# EAGLE board chipKIT Max32 (EAGLE 5.11)
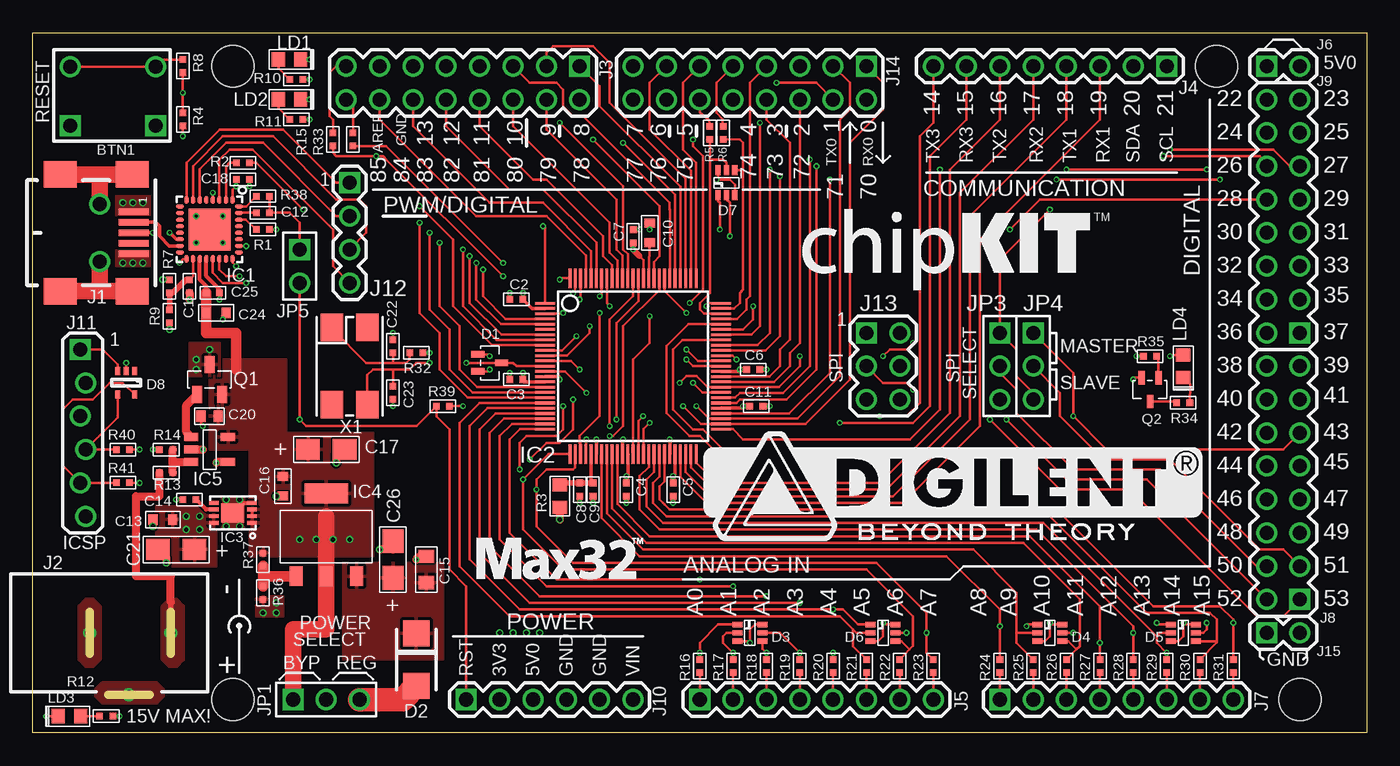
[diagram p5: board, top side]
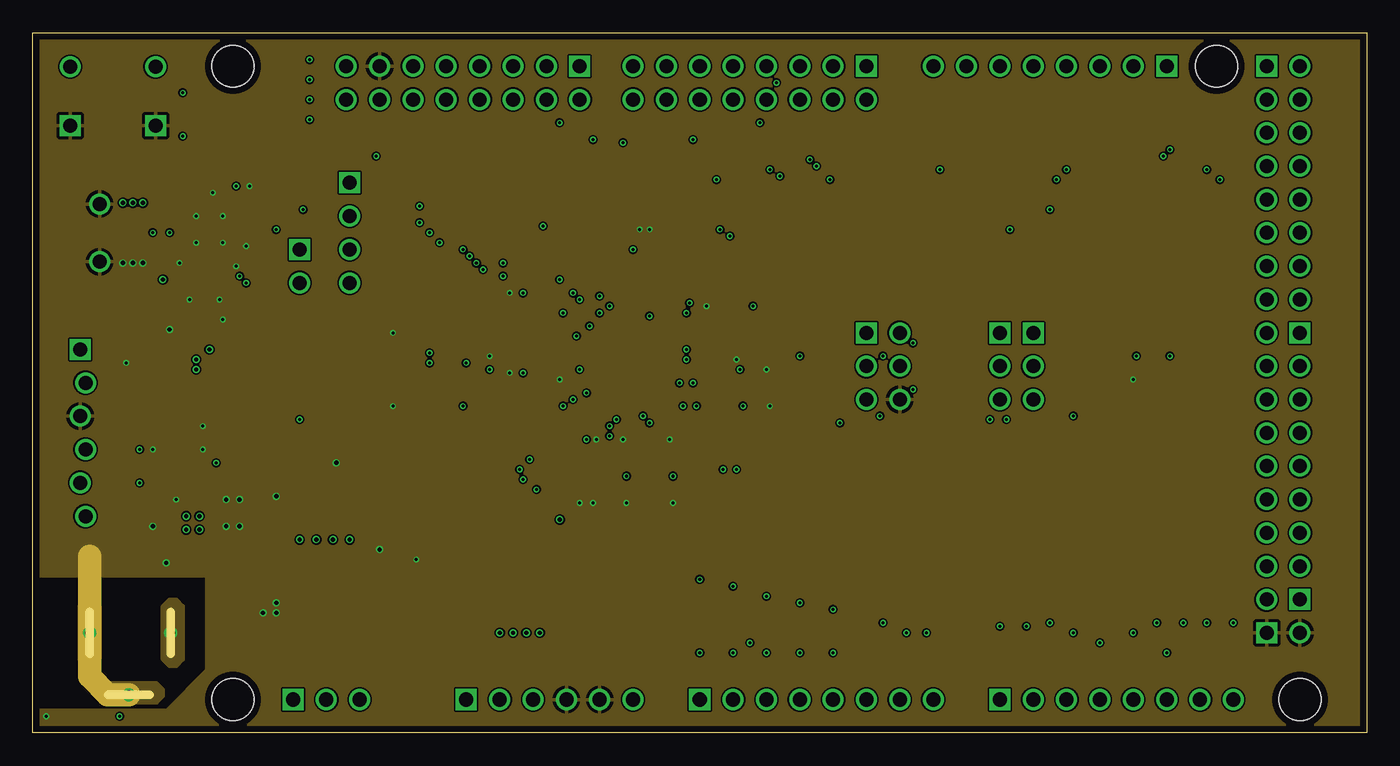
[diagram p6: board, inner layer Route2]
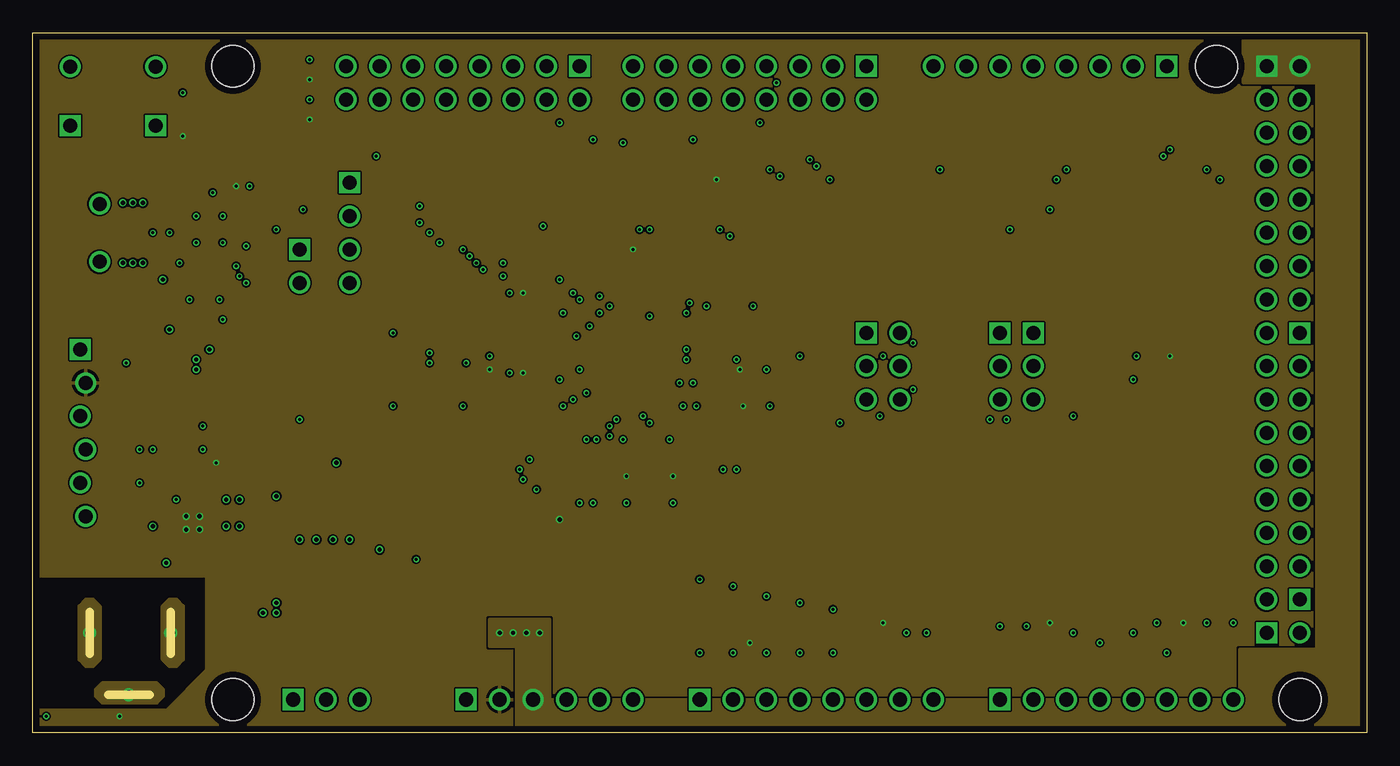
[diagram p7: board, inner layer Route15]
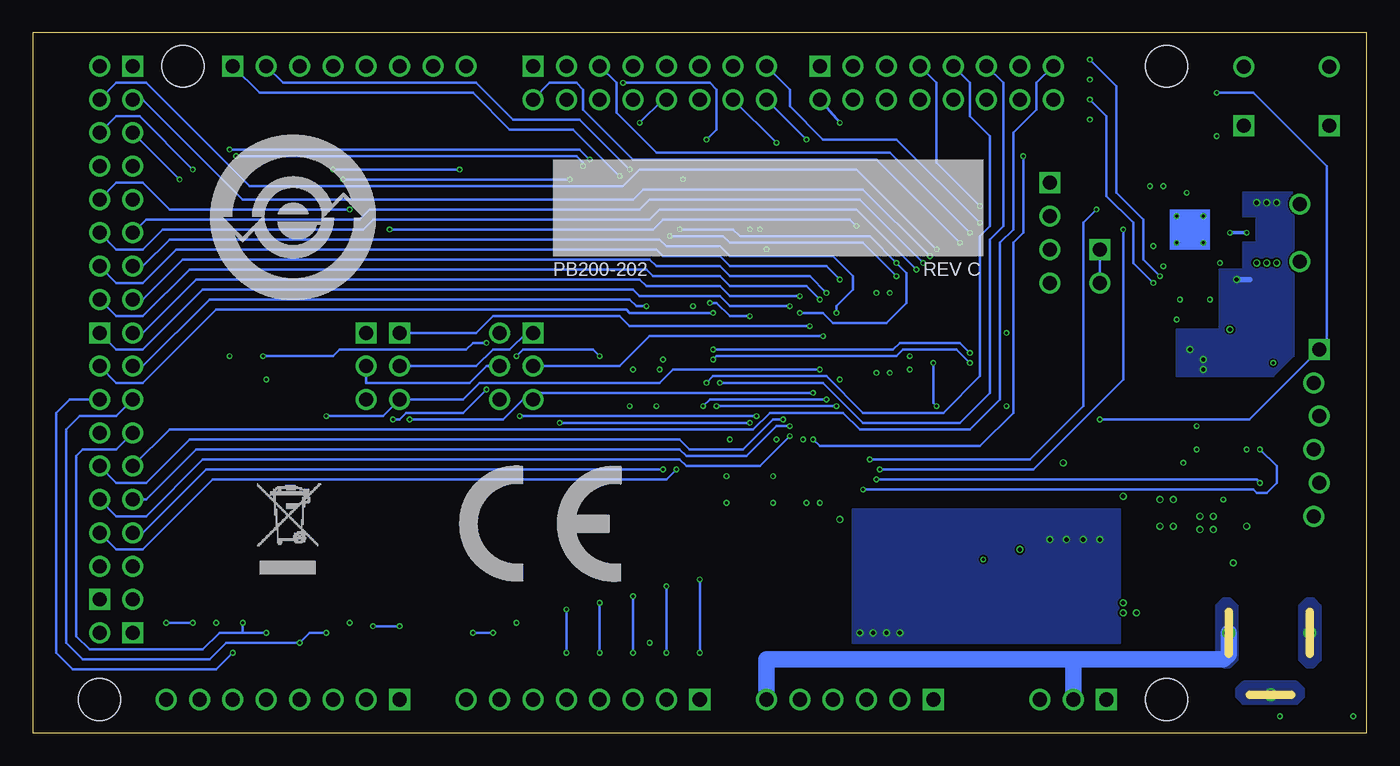
[diagram p8: board, bottom side, seen from below]

Size 101.6 x 53.34 mm. Coordinates in mm from the lower left corner, seen from the top.
Outline: 0,0 0,53.34 101.6,53.34 101.6,0 0,0
Copper layers (1+2*15+16): Top 0.035mm / dielectric 0.3mm / Route2 0.035mm / dielectric 0.83mm / Route15 0.035mm / dielectric 0.3mm / Bottom 0.035mm
Design rules "default *": minimum track width 7mil, minimum drill 9mil, track to track 5mil, track to pad 5mil, pad to pad 5mil, via to via 5mil, smd to smd 0mil, copper to edge 20mil, drill to drill 8mil, minimum pad ring 4mil, minimum via ring 4mil, stop-mask expansion 0mil, vias tented up to drill 15mil, thermal gap 10mil
Holes 3.2 mm at 15.24,50.8 15.24,2.54 90.17,50.8 96.52,2.54

## Footprints (pad centres in the part's own frame; a part is rotated, then mirrored left to right if it is on the bottom)
SW-P8008 = drill 1.067 square: 1A -2,3.5; 2A -2,-3 | drill 1.067 round: 1B 2.5,3.5; 2B 2.5,-3
C0402S = smd 0.5 x 0.5: 1 -0.5,0; 2 0.5,0
C0603S = smd 0.7 x 0.8: 1 -0.75,0; 2 0.75,0
C0805S = smd 1 x 1.2: 1 -1,0; 2 1,0
CPOL3216 = smd 1.8 x 1.6: + -1.4,0; - 1.4,0
C0402 = smd 0.7 x 0.9: 1 -0.65,0; 2 0.65,0
SOT-323 = smd 0.5 x 1: 1 -0.65,-0.9; 2 0.65,-0.9; 3 0,0.9
SMA = smd 2 x 2: A 2,0; C -2,0
SOT-363 = smd 0.4 x 0.762: 1 -0.635,-0.953; 2 0,-0.953; 3 0.635,-0.953; 4 0.635,0.953; 5 0,0.953; 6 -0.635,0.953
SOT-323-5 = smd 0.4 x 0.6: 1 -0.65,-0.9; 2 0,-0.9; 3 0.65,-0.9; 4 0.65,0.9; 5 -0.65,0.9
QFN32 = smd 0.6 x 0.3: 1 -2.25,1.75; 2 -2.25,1.25; 3 -2.25,0.75; 4 -2.25,0.25; 5 -2.25,-0.25; 6 -2.25,-0.75; 7 -2.25,-1.25; 8 -2.25,-1.75; 17 2.25,-1.75; 18 2.25,-1.25; 19 2.25,-0.75; 20 2.25,-0.25; 21 2.25,0.25; 22 2.25,0.75; 23 2.25,1.25; 24 2.25,1.75 | smd 0.3 x 0.6: 9 -1.75,-2.25; 10 -1.25,-2.25; 11 -0.75,-2.25; 12 -0.25,-2.25; 13 0.25,-2.25; 14 0.75,-2.25; 15 1.25,-2.25; 16 1.75,-2.25; 25 1.75,2.25; 26 1.25,2.25; 27 0.75,2.25; 28 0.25,2.25; 29 -0.25,2.25; 30 -0.75,2.25; 31 -1.25,2.25; 32 -1.75,2.25 | smd 3.2 x 3.2: PAD 0,0
TQ100-PT = smd 1.5 x 0.2: 1 -6.7,4.8; 2 -6.7,4.4; 3 -6.7,4; 4 -6.7,3.6; 5 -6.7,3.2; 6 -6.7,2.8; 7 -6.7,2.4; 8 -6.7,2; 9 -6.7,1.6; 10 -6.7,1.2; 11 -6.7,0.8; 12 -6.7,0.4; 13 -6.7,0; 14 -6.7,-0.4; 15 -6.7,-0.8; 16 -6.7,-1.2; 17 -6.7,-1.6; 18 -6.7,-2; 19 -6.7,-2.4; 20 -6.7,-2.8; 21 -6.7,-3.2; 22 -6.7,-3.6; 23 -6.7,-4; 24 -6.7,-4.4; 25 -6.7,-4.8; 51 6.7,-4.8; 52 6.7,-4.4; 53 6.7,-4; 54 6.7,-3.6; 55 6.7,-3.2; 56 6.7,-2.8; 57 6.7,-2.4; 58 6.7,-2; 59 6.7,-1.6; 60 6.7,-1.2; 61 6.7,-0.8; 62 6.7,-0.4; 63 6.7,0; 64 6.7,0.4; 65 6.7,0.8; 66 6.7,1.2; 67 6.7,1.6; 68 6.7,2; 69 6.7,2.4; 70 6.7,2.8; 71 6.7,3.2; 72 6.7,3.6; 73 6.7,4; 74 6.7,4.4; 75 6.7,4.8 | smd 0.2 x 1.5: 26 -4.8,-6.7; 27 -4.4,-6.7; 28 -4,-6.7; 29 -3.6,-6.7; 30 -3.2,-6.7; 31 -2.8,-6.7; 32 -2.4,-6.7; 33 -2,-6.7; 34 -1.6,-6.7; 35 -1.2,-6.7; 36 -0.8,-6.7; 37 -0.4,-6.7; 38 0,-6.7; 39 0.4,-6.7; 40 0.8,-6.7; 41 1.2,-6.7; 42 1.6,-6.7; 43 2,-6.7; 44 2.4,-6.7; 45 2.8,-6.7; 46 3.2,-6.7; 47 3.6,-6.7; 48 4,-6.7; 49 4.4,-6.7; 50 4.8,-6.7; 76 4.8,6.7; 77 4.4,6.7; 78 4,6.7; 79 3.6,6.7; 80 3.2,6.7; 81 2.8,6.7; 82 2.4,6.7; 83 2,6.7; 84 1.6,6.7; 85 1.2,6.7; 86 0.8,6.7; 87 0.4,6.7; 88 0,6.7; 89 -0.4,6.7; 90 -0.8,6.7; 91 -1.2,6.7; 92 -1.6,6.7; 93 -2,6.7; 94 -2.4,6.7; 95 -2.8,6.7; 96 -3.2,6.7; 97 -3.6,6.7; 98 -4,6.7; 99 -4.4,6.7; 100 -4.8,6.7
DFN8-MC = smd 0.3 x 0.75: 1 -0.75,-1.45; 2 -0.25,-1.45; 3 0.25,-1.45; 4 0.75,-1.45; 5 0.75,1.45; 6 0.25,1.45; 7 -0.25,1.45; 8 -0.75,1.45 | smd 1.45 x 1.75: PAD 0,0
SOT223 = smd 1 x 1.5: 1 -2.3,0; 2 0,0; 3 2.3,0 | smd 3.3 x 1.5: TAB 0,6.3
SOT23-5-OT = smd 0.6 x 1.1: 1 -0.95,-1.4; 2 0,-1.4; 3 0.95,-1.4; 4 0.95,1.4; 5 -0.95,1.4
USB-AB-MINI = smd 0.5 x 2.3: 1 -1.6,2.6; 2 -0.8,2.6; 3 0,2.6; 4 0.8,2.6; 5 1.6,2.6 | smd 2 x 2.5: S1 -4.45,2.5; S2 -4.45,-3; S3 4.45,-3; S4 4.45,2.5 | drill 1.067 round: S5 -2.2,0; S6 2.2,0
KLD-0202S = drill 0.66 round: 1 6.2,0; 2 0,0; 3 3,-4.7
HDR-2X8 = drill 1.067 square: 1 -1.27,8.89 | drill 1.067 round: 2 1.27,8.89; 3 -1.27,6.35; 4 1.27,6.35; 5 -1.27,3.81; 6 1.27,3.81; 7 -1.27,1.27; 8 1.27,1.27; 9 -1.27,-1.27; 10 1.27,-1.27; 11 -1.27,-3.81; 12 1.27,-3.81; 13 -1.27,-6.35; 14 1.27,-6.35; 15 -1.27,-8.89; 16 1.27,-8.89
HDR-1X8 = drill 1.067 square: 1 0,8.89 | drill 1.067 round: 2 0,6.35; 3 0,3.81; 4 0,1.27; 5 0,-1.27; 6 0,-3.81; 7 0,-6.35; 8 0,-8.89
HDR-1X2 = drill 1.067 square: 1 0,1.27 | drill 1.067 round: 2 0,-1.27
HDR-1X6 = drill 1.067 square: 1 0,6.35 | drill 1.067 round: 2 0,3.81; 3 0,1.27; 4 0,-1.27; 5 0,-3.81; 6 0,-6.35
HDR-1X6_OFFSET = drill 1.067 square: 1 -0.203,6.35 | drill 1.067 round: 2 0.203,3.81; 3 -0.203,1.27; 4 0.203,-1.27; 5 -0.203,-3.81; 6 0.203,-6.35
HDR-1X4 = drill 1.067 square: 1 0,3.81 | drill 1.067 round: 2 0,1.27; 3 0,-1.27; 4 0,-3.81
HDR-2X3 = drill 1.067 square: 1 -1.27,2.54 | drill 1.067 round: 2 1.27,2.54; 3 -1.27,0; 4 1.27,0; 5 -1.27,-2.54; 6 1.27,-2.54
JPR-1X3 = drill 1.067 square: 1 0,2.54 | drill 1.067 round: 2 0,0; 3 0,-2.54
JPR-1X2 = drill 1.067 square: 1 0,1.27 | drill 1.067 round: 2 0,-1.27
D0603 = smd 1 x 1.1: A 0.85,0; C -0.85,0
SOT23 = smd 0.762 x 1.27: 1 -0.953,-1.143; 2 0.953,-1.143; 3 0,1.143
R0402S = smd 0.5 x 0.5: 1 -0.5,0; 2 0.5,0
R0603 = smd 1 x 1.1: 1 -0.85,0; 2 0.85,0
FQ7050B = smd 2.1 x 1.7: 1 -2.95,-1.35; 2 2.95,-1.35; 3 2.95,1.35; 4 -2.95,1.35

## Placement (x,y rotation side)
BTN1  SW-P8008  [SW-P8008]  6.35,48.26 90 top
C1  0.1uF  [C0402S]  11.94,34.04 270 top
C2  0.1uF  [C0402S]  36.83,33.02 180 top
C3  0.1uF  [C0402S]  36.83,26.92 180 top
C4  0.1uF  [C0402S]  45.21,18.54 270 top
C5  0.1uF  [C0402S]  48.77,18.54 270 top
C6  0.1uF  [C0402S]  54.86,27.69 0 top
C7  0.1uF  [C0402S]  45.72,37.85 90 top
C8  1uF  [C0402S]  41.66,18.54 270 top
C9  0.1uF  [C0402S]  42.67,18.54 270 top
C10  10uF  [C0603S]  46.99,38.1 90 top
C11  0.1uF  [C0402S]  55.12,24.89 0 top
C12  0.1uF  [C0402S]  17.53,39.62 0 top
C13  4.7uF  [C0603S]  9.91,16.26 180 top
C14  1nF  [C0402S]  11.94,17.78 180 top
C15  10uF/25V  [C0805S]  29.97,12.45 90 top
C16  10uF  [C0603S]  19.05,18.8 270 top
C17  10uF  [CPOL3216]  22.35,21.59 0 top
C18  0.1uF  [C0402S]  16,42.16 0 top
C20  0.1uF  [C0402]  13.46,24.13 180 top
C21  22uF  [CPOL3216]  10.92,13.97 180 top
C22  30pF  [C0402S]  27.43,29.46 90 top
C23  30pF  [C0402S]  27.43,25.91 270 top
C24  NL  [C0603S]  13.97,32 0 top
C25  0.1uF  [C0402S]  13.72,33.53 0 top
C26  10uF/25V  [CPOL3216]  27.43,13.21 90 top
D1  BAV99W  [SOT-323]  34.8,28.19 270 top
D2  B220A  [SMA]  29.21,5.59 270 top
D3  BAV70S  [SOT-363]  54.61,7.62 270 top
D4  BAV70S  [SOT-363]  77.47,7.62 270 top
D5  BAV70S  [SOT-363]  87.63,7.62 270 top
D6  BAV70S  [SOT-363]  64.77,7.62 270 top
D7  BAV70S  [SOT-363]  52.83,41.91 0 top
D8  NSQA6V8  [SOT-323-5]  7.11,26.67 180 top
IC1  FT232RQ  [QFN32]  13.46,38.35 270 top
IC2  PIC32MX7X5FL-PT  [TQ100-PT]  45.72,27.94 0 top
IC3  MCP1725-330F/MC  [DFN8-MC]  15.24,16.76 90 top
IC4  NCP1117DT50T3G  [SOT223]  22.35,11.94 0 top
IC5  MCP6001-OT  [SOT23-5-OT]  13.46,21.59 270 top
J1  USB-AB-MINI  [USB-AB-MINI]  5.08,38.1 270 top
J2  CON-COAX-KLD0202-S  [KLD-0202S]  4.32,7.62 0 top
J3  HDR-2X8  [HDR-2X8]  32.77,49.53 270 top
J4  HDR-1X8  [HDR-1X8]  77.47,50.8 270 top
J5  HDR-1X8  [HDR-1X8]  59.69,2.54 90 top
J6  HDR-1X2  [HDR-1X2]  95.25,50.8 90 top
J7  HDR-1X8  [HDR-1X8]  82.55,2.54 90 top
J8  HDR-2X8  [HDR-2X8]  95.25,19.05 180 top
J9  HDR-2X8  [HDR-2X8]  95.25,39.37 180 top
J10  HDR-1X6  [HDR-1X6]  39.37,2.54 90 top
J11  No Load  [HDR-1X6_OFFSET]  3.81,22.86 0 top
J12  HDR-1X4  [HDR-1X4]  24.13,38.1 0 top
J13  HDR-2X3  [HDR-2X3]  64.77,27.94 0 top
J14  HDR-2X8  [HDR-2X8]  54.61,49.53 270 top
J15  HDR-1X2  [HDR-1X2]  95.25,7.62 90 top
JP1  JPR-1X3  [JPR-1X3]  22.35,2.54 90 top
JP3  JPR-1X3  [JPR-1X3]  73.66,27.94 0 top
JP4  JPR-1X3  [JPR-1X3]  76.2,27.94 0 top
JP5  No Load  [JPR-1X2]  20.32,35.56 0 top
LD1  LED-S0603-RED  [D0603]  19.56,51.31 180 top
LD2  LED-S0603-RED  [D0603]  19.56,48.26 180 top
LD3  LED-S0603-RED  [D0603]  2.79,1.27 0 top
LD4  LED-S0603-GRN  [D0603]  87.63,27.94 90 top
LOGO1  ROHS-CHINA-INV  [ROHS_CHINA_INV_LOGO]  89.41,32 0 bottom
LOGO2  WEEE-L  [WEEE_LOGO2]  85.6,11.43 0 bottom
LOGO4  MAX32_LOGO  [MAX32_LOGO]  33.78,11.68 0 top
LOGO5  CHIPKIT  [CHIPKIT_LOGO]  58.67,33.78 0 top
LOGO6  CE  [CE_LOGO]  69.34,11.43 0 bottom
LOGO7  DIGILENT_INC-BT-1500  [DIGILENT_BEYOND_1500_LOGO]  50.55,14.73 0 top
Q1  FDN340P  [SOT23]  13.46,26.92 0 top
Q2  MMBT3904WT1G  [SOT-323]  85.09,26.16 180 top
R1  1K  [R0402S]  17.53,38.35 0 top
R2  1K  [R0402S]  16,43.43 0 top
R3  0  [R0603]  40.13,18.03 90 top
R4  10K  [R0402S]  11.43,46.74 270 top
R5  200  [R0402S]  51.56,45.72 90 top
R6  200  [R0402S]  52.58,45.72 90 top
R7  4.7K  [R0402S]  10.41,34.04 90 top
R8  200  [R0402S]  11.43,50.8 270 top
R9  10K  [R0402S]  10.41,31.75 90 top
R10  470  [R0402S]  20.07,49.78 0 top
R11  470  [R0402S]  20.07,46.74 0 top
R12  470  [R0402S]  5.59,1.27 0 top
R13  10K  [R0402S]  10.16,19.81 180 top
R14  10K  [R0402S]  10.16,21.59 0 top
R15  200  [R0402S]  22.86,45.21 90 top
R16  200  [R0402S]  50.8,5.08 270 top
R17  200  [R0402S]  53.34,5.08 270 top
R18  200  [R0402S]  55.88,5.08 270 top
R19  200  [R0402S]  58.42,5.08 270 top
R20  200  [R0402S]  60.96,5.08 270 top
R21  200  [R0402S]  63.5,5.08 270 top
R22  200  [R0402S]  66.04,5.08 270 top
R23  200  [R0402S]  68.58,5.08 270 top
R24  200  [R0402S]  73.66,5.08 270 top
R25  200  [R0402S]  76.2,5.08 270 top
R26  200  [R0402S]  78.74,5.08 270 top
R27  200  [R0402S]  81.28,5.08 270 top
R28  200  [R0402S]  83.82,5.08 270 top
R29  200  [R0402S]  86.36,5.08 270 top
R30  200  [R0402S]  88.9,5.08 270 top
R31  200  [R0402S]  91.44,5.08 270 top
R32  0  [R0402S]  29.21,28.96 0 top
R33  200  [R0402S]  24.38,45.21 90 top
R34  470  [R0402S]  87.63,25.15 0 top
R35  4.7K  [R0402S]  85.09,28.7 0 top
R36  0  [R0402S]  17.53,10.67 90 top
R37  NL  [R0402S]  17.53,13.21 90 top
R38  100  [R0402S]  17.53,40.89 0 top
R39  50  [R0402S]  31.24,24.89 180 top
R40  50  [R0402S]  6.86,21.59 180 top
R41  50  [R0402S]  6.86,19.05 180 top
X1  FQ7050B-8.000  [FQ7050B]  24.13,27.94 270 top

## Tracks (layer width: path | path; a pad name or v marks a point on that pad's centre or on a via)
AC2RX  (via drill 0.23)
  Top 0.203: IC2.8 35.34,29.94 32.77,32.51 v32.77,36.83
  Bottom 0.203: J9.15 95.25,49.53 92.96,49.53 85.09,41.66 56.64,41.66 55.37,42.93 38.86,42.93 v32.77,36.83
AC2TX  (via drill 0.23)
  Top 0.203: IC2.7 35.7,30.34 33.27,32.77 v33.27,36.32
  Bottom 0.203: J9.16 93.22,48.26 85.6,40.64 55.88,40.64 55.12,41.4 38.35,41.4 v33.27,36.32
AN0
  Top 0.203: J5.1 R16.2
AN0-R  (via drill 0.23)
  Top 0.203: IC2.25 37.11,23.14 36.32,22.35 36.32,15.24 39.88,11.68 v50.8,11.68 | R16.1 v50.8,6.1 50.8,6.86 52.2,8.26 D3.1
  Bottom 0.203: v50.8,11.68 v50.8,6.1
AN1
  Top 0.203: J5.2 R17.2
AN1-R  (via drill 0.23)
  Top 0.203: IC2.24 36.49,23.54 35.56,22.61 35.56,14.73 39.12,11.18 v53.34,11.18 | R17.1 v53.34,6.1 52.58,6.86 52.58,7.37 52.83,7.62 D3.2
  Bottom 0.203: v53.34,11.18 v53.34,6.1
AN2
  Top 0.203: J5.3 R18.2
AN3
  Top 0.203: J5.4 R19.2
AN4
  Top 0.203: J5.5 R20.2
AN5
  Top 0.203: J5.6 R21.2
AN6
  Top 0.203: J5.7 R22.2
AN7
  Top 0.203: J5.8 R23.2
AN8
  Top 0.203: J7.1 R24.2
AN9
  Top 0.203: J7.2 R25.2
AN10
  Top 0.203: J7.3 R26.2
AN11
  Top 0.203: J7.4 R27.2
AN12
  Top 0.203: J7.5 R28.2
AN13
  Top 0.203: J7.6 R29.2
AN14/PMALH
  Top 0.203: J7.7 R30.2
AN15/PMALL
  Top 0.203: J7.8 R31.2
AVCC
  Top 0.254: IC2.30 42.52,19.19 C9.1
  Top 0.406: C9.1 C8.1 40.14,19.04 40.13,19.05 R3.2
EMDC/PMCS1  (via drill 0.23)
  Top 0.203: v52.58,20.07 52.58,20.83 50.8,22.61 50.04,22.61 48.26,24.38 48.26,29.46 49.94,31.14 IC2.71
  Bottom 0.203: J8.5 95.25,13.97 93.22,13.97 87.88,19.3 53.34,19.3 v52.58,20.07
EMDIO  (via drill 0.23)
  Top 0.203: v53.59,20.07 53.59,20.57 51.05,23.11 50.29,23.11 48.77,24.64 48.77,29.21 49.5,29.94 IC2.68
  Bottom 0.203: J8.6 93.22,15.24 88.39,20.07 v53.59,20.07
ERXD0  (via drill 0.23)
  Top 0.203: IC2.41 46.92,20.25 46.23,19.56 46.23,17.02 47.75,15.49 76.45,15.49 83.82,8.13 v83.82,7.62 R28.1 | D5.1 85.72,8.26 v85.6,8.38
  Bottom 0.203: J8.12 95.25,21.59 97.79,21.59 98.3,21.08 98.3,7.37 97.28,6.35 88.65,6.35 87.38,7.62 85.6,7.62 | v83.82,7.62 85.6,7.62 | 85.6,7.62 v85.6,8.38
ERXD1  (via drill 0.23)
  Top 0.203: IC2.42 47.32,19.89 46.74,19.3 46.74,17.27 48.01,16 76.96,16 85.6,7.37 | 85.6,7.37 85.6,6.85 v86.35,6.1 v86.36,6.1 R29.1 | D5.2 85.85,7.62 85.6,7.37
  Bottom 0.203: J8.13 98.81,25.4 99.82,24.38 99.82,6.1 98.55,4.83 87.63,4.83 v86.36,6.1
ERXERR  (via drill 0.23)
  Top 0.203: IC2.35 44.52,17.46 46.99,14.99 75.95,14.99 81.28,9.65 v81.28,6.86 R27.1 | v79.25,7.62 D4.5
  Bottom 0.203: J8.14 95.25,24.13 98.04,24.13 99.06,23.11 99.06,6.86 97.79,5.59 88.14,5.59 86.87,6.86 v81.29,6.85 arc-90 v81.28,6.86 80.52,7.62 v79.25,7.62
ETXD0  (via drill 0.23)
  Top 0.203: IC2.88 45.72,33.27 43.94,31.5 v43.94,23.37
  Bottom 0.203: J8.8 92.96,17.78 89.15,21.59 52.32,21.59 51.82,21.08 47.24,21.08 44.96,23.37 v43.94,23.37
ETXD1  (via drill 0.23)
  Top 0.203: IC2.87 46.12,32.91 44.45,31.24 v44.45,23.88
  Bottom 0.203: J8.9 95.25,19.05 92.96,19.05 89.66,22.35 52.32,22.35 51.56,21.59 47.5,21.59 45.21,23.88 v44.45,23.88
ETXEN/RD6  (via drill 0.23)
  Top 0.203: IC2.83 47.72,33.75 44.96,30.99 44.96,23.37 44.2,22.61 v43.94,22.61
  Bottom 0.203: J8.7 95.25,16.51 92.96,16.51 88.65,20.83 52.32,20.83 51.82,20.32 46.23,20.32 v43.94,22.61
GND  (via drill 0.23, 0.23 pad 0.41, 0.33, 0.33 pad 0.41, 0.33 pad 0.53)
  Top 0.203: C10.2 46.98,38.85 v46.99,38.35 | C22.2 v27.43,30.48 | v27.43,24.89 C23.2 | IC2.75 51.54,32.74 v51.31,32.51 | IC2.65 53.3,28.74 v53.59,28.45 | D1.1 34.69,28.84 v34.8,28.7 | Q2.2 83.96,27.06 v83.82,26.92 | C18.2 v16.5,41.66 v16.51,41.66 | IC1.4 v13.72,41.15 | IC1.17 11.47,36.1 v11.18,35.81 | IC1.24 15.21,35.84 v15.49,35.56 | IC1.26 16.24,37.1 v16.26,37.08 | LD3.C v1.02,1.27 | C20.2 12.81,23.51 v12.95,23.37 | D8.2 v7.11,28.19
  Top 0.254: IC2.45 v48.52,22.35 v48.51,22.35 | IC2.36 44.92,22.31 v44.96,22.35 | IC2.31 v42.92,22.35 v42.93,22.35 | IC2.15 40.09,27.14 v40.13,26.92
  Top 0.305: C2.2 v36.33,33.52 v36.32,33.53 | C3.2 36.33,27.19 v36.32,27.43 | C14.2 v10.92,17.78 | IC3.4 15.99,17.51 IC3.PAD | IC1.20 13.21,34.79 14.22,33.79 C25.2 v14.22,33.02 | C24.2 14.48,31.76 v14.48,31.5
  Top 0.406: v41.66,17.53 C8.2 | v42.67,17.53 C9.2 | v45.21,17.53 C4.2 | v48.77,17.53 C5.2 | C6.2 v55.88,27.69 | C11.2 v56.13,24.89 | C7.2 v46.23,38.35 | C16.2 19.06,18.02 v18.54,18.03 | R14.1 v9.14,21.59 | R9.1 v10.41,30.73
  Top 0.61: C15.2 29.48,13.45 v29.21,13.21 | IC5.2 v12.95,21.59 | C17.- 23.11,21.21 v23.11,20.57 | C21.- 10.16,13.33 v10.16,12.95 | C13.2 9.14,16.24 v9.14,15.75 | C26.- 27.43,13.97 v26.42,13.97 | C1.2 v11.94,33.02
  Top 1.27: J1.S2 5.08,42.55 | 5.08,42.55 J1.S5 | 5.08,42.55 J1.S1 | 5.08,33.65 J1.S6 | 5.08,33.65 J1.S4 | J1.S3 5.08,33.65
  Route2 1.778: J2.3 5.72,2.92 4.32,4.32 J2.2 4.32,13.46
  other vias: 6.86,35.81 7.62,35.81 8.38,35.81 18.54,9.91 18.54,9.14 17.53,9.14 14.73,17.78 15.75,17.78 14.73,15.75 15.75,15.75 12.45,39.37 14.48,39.37 12.45,37.34 14.48,37.34
  pour Route2: 0,53.34 101.6,53.34 101.6,0 0,0 0,1.78 10.16,1.78 13.21,4.83 13.21,5.08 13.21,11.94 0.51,11.94
  pour Top (isolate 0.254, no thermals): 6.35,36.83 8.89,36.83 8.89,35.56 6.35,35.56
  pour Bottom (no thermals): 3.56,9.65 4.06,10.16 4.57,10.16 5.08,9.65 5.08,5.59 4.57,5.08 4.06,5.08 3.56,5.59
  pour Route15 (no thermals): 3.56,9.65 4.06,10.16 4.57,10.16 5.08,9.65 5.08,5.59 4.57,5.08 4.06,5.08 3.56,5.59
  pour Top (no thermals): 3.56,9.65 4.06,10.16 4.57,10.16 5.08,9.65 5.08,5.59 4.57,5.08 4.06,5.08 3.56,5.59
  pour Route2 (no thermals): 3.56,5.59 3.56,9.65 4.06,10.16 4.57,10.16 5.08,9.65 5.08,5.59 4.57,5.08 4.06,5.08
  pour Route2 (no thermals): 9.4,2.29 5.33,2.29 4.83,2.79 4.83,3.3 5.33,3.81 9.4,3.81 9.91,3.3 9.91,2.79
  pour Bottom (no thermals): 5.33,2.29 4.83,2.79 4.83,3.3 5.33,3.81 9.4,3.81 9.91,3.3 9.91,2.79 9.4,2.29
  pour Route15 (no thermals): 5.33,2.29 4.83,2.79 4.83,3.3 5.33,3.81 9.4,3.81 9.91,3.3 9.91,2.79 9.4,2.29
  pour Top (no thermals): 5.33,2.29 4.83,2.79 4.83,3.3 5.33,3.81 9.4,3.81 9.91,3.3 9.91,2.79 9.4,2.29
  pour Top: 17.02,10.41 19.05,10.41 19.05,8.89 17.02,8.89
  pour Top (isolate 0.254, rank 3, no thermals): 14.22,18.03 16.26,18.03 16.26,15.49 14.22,15.49
IC5
  Top 0.203: IC2.79 49.32,41.61 43.18,47.75 43.18,49.28 J3.1
INT1/RE8  (via drill 0.23)
  Top 0.203: IC2.18 33.5,25.94 31.75,27.69 31.75,30.73 30.23,32.26 v30.23,38.1
  Bottom 0.203: v30.23,38.1 36.32,44.2 54.1,44.2 57.15,47.24 57.15,49.53 J14.5
INT2/RE9  (via drill 0.23)
  Top 0.203: IC2.19 33.13,25.54 30.99,27.69 30.99,30.48 29.46,32 v29.46,38.86
  Bottom 0.203: v29.46,38.86 35.81,45.21 41.4,45.21 43.94,47.75 43.94,49.02 J14.15
MISO
  Top 0.203: J8.4 93.22,12.7 85.85,20.07 79.25,20.07 74.93,24.38 74.93,26.16 73.66,27.43 JP3.2
  Bottom 0.203: JP3.2 67.82,27.94 66.55,29.21 65.28,29.21 64.01,30.48 J13.1
MOSI
  Top 0.203: J8.3 95.25,13.97 93.47,13.97 86.61,20.83 81.53,20.83 78.23,24.13 78.23,25.91 JP4.2
  Bottom 0.203: J13.4 67.06,27.94 68.33,26.67 76.2,26.67 JP4.2
N$1  (via drill 0.23)
  Top 0.254: IC1.14 10.91,37.6 v10.41,38.1 | J1.3 v9.14,38.1
  Bottom 0.254: v9.14,38.1 v10.41,38.1
N$2
  Top 0.254: IC1.15 10.39,37.1 9.65,37.85 9.65,38.61 9.36,38.9 J1.2
N$3
  Top 0.813: 17.53,11.94 IC4.1 | 17.53,11.94 R37.1 | R36.2 17.53,11.94
N$4
  Top 0.203: IC1.30 16.2,39.1 R1.1
N$5
  Top 0.203: IC2.85 46.92,36.25 46.99,36.32 C10.1
N$6
  Top 0.203: IC1.2 14.71,43.16 14.99,43.43 R2.1
N$7
  Top 0.203: IC2.73 51.12,31.94 50.8,32.26 50.8,32.77 51.56,33.53 51.56,43.69 | R5.1 51.35,45.21 51.56,45 51.56,43.69 | D7.5 52.83,43.43 52.58,43.69 51.56,43.69
N$8
  Top 0.203: IC1.31 15.73,39.62 C12.1
N$9
  Top 0.203: BTN1.1B BTN1.2B 9.89,51.3 R8.1
N$10
  Top 0.203: IC1.8 11.71,43.46 14.22,45.97 19.05,45.97 23.11,41.91 J12.1
N$11
  Top 0.203: IC2.74 53.42,32.34 53.85,32.77 53.85,33.53 54.1,33.78 54.1,42.93 | 54.1,42.93 54.1,44.96 53.85,45.21 R6.1 | D7.4 54.04,42.86 54.1,42.93
N$13
  Top 0.203: IC1.6 12.71,42.94 14.73,44.96 17.53,44.96 23.11,39.37 J12.2
N$14
  Top 0.203: IC1.7 12.21,43.2 14.48,45.47 18.29,45.47 23.11,40.64 24.89,40.64 25.4,40.13 25.4,38.1 J12.3
N$15
  Top 0.203: IC1.3 14.21,43.68 14.99,44.45 16.76,44.45 22.86,38.35 22.86,35.56 J12.4
N$17  (via drill 0.23)
  Top 0.203: v21.08,51.31 LD1.C | IC1.22 14.21,35.32 14.73,34.8 v15.75,34.8
  Bottom 0.203: v15.75,34.8 17.02,36.07 17.02,39.12 19.05,41.15 19.05,49.28 v21.08,51.31
N$18  (via drill 0.23)
  Top 0.203: v21.08,48.26 LD2.C | IC1.21 13.71,35.06 14.48,34.29 v16.26,34.29
  Bottom 0.203: v16.26,34.29 17.78,35.81 17.78,38.86 19.81,40.89 19.81,46.99 v21.08,48.26
N$19
  Top 0.203: LD2.A 18.71,47.59 R11.1
N$20
  Top 0.203: LD1.A 18.71,50.64 R10.1
N$21
  Top 0.305: IC3.6 13.2,17.01 C14.1
N$22
  Top 0.203: LD3.A R12.1
N$23
  Top 1.778: JP1.3 28.16,2.54 D2.A
N$24
  Top 0.61: Q1.1 11.68,24.96 11.68,22.92 IC5.1
N$25  (via drill 0.23)
  Top 0.203: D7.1 52.2,40.51 52.32,40.39 v52.32,38.35 | IC2.28 41.72,22.03 41.66,22.1 41.66,22.61 43.18,24.13 v43.18,32 | v35.81,35.81 26.92,44.7 24.39,44.7 R33.1
  Bottom 0.203: v52.32,38.35 48.26,38.35 47.75,37.85 37.85,37.85 v35.81,35.81 35.05,35.05 35.05,32.77 36.58,31.24 40.64,31.24 41.4,32 v43.18,32
N$26
  pour Top: 23.62,12.95 31.24,12.95 31.24,5.59 23.62,5.59
N$28
  Top 0.203: Q2.3 86.96,25.26 R34.1
N$30
  Top 0.203: IC1.18 12.21,34.81 C1.1
  Top 0.406: C1.1 11.67,34.54 11.18,34.04 10.68,33.54 R7.1 R9.2
N$31
  Top 0.203: R40.2 J11.4 6.46,24.04 D8.4
N$32
  Top 0.203: IC1.32 16.24,40.1 R38.1
N$33
  Top 0.203: R41.2 J11.5 2.29,20.37 2.29,24.64 3.05,25.4 4.57,25.4 5.84,26.67 6.86,26.67 D8.5
N$34
  Top 0.203: Q2.1 85.74,28.6 R35.2
N$35  (via drill 0.23)
  Top 0.203: IC2.29 42.12,22.31 v42.16,22.35 | D7.2 52.83,40.64 53.09,40.39 v53.09,37.85 | v35.81,34.8 26.92,43.69 26.67,43.94 v26.16,43.94 23.11,43.94 22.86,44.2 R15.1
  Bottom 0.203: v42.16,22.35 41.66,21.84 29.46,21.84 26.92,24.38 26.92,37.34 26.16,38.1 v26.16,43.94 | v53.09,37.85 49.02,37.85 48.51,37.34 38.35,37.34 v35.81,34.8
N$36
  Top 0.203: R34.2 88.18,26.54 LD4.C
N$37  (via drill 0.23)
  Top 0.203: IC2.64 50.65,28.34 v49.78,29.21 | R32.2 v30.23,28.96
  Bottom 0.203: v49.78,29.21 36.07,29.21 35.56,29.72 30.99,29.72 v30.23,28.96
N$38  (via drill 0.23 pad 0.41)
  Top 0.203: IC2.13 36.83,27.94 36.58,28.19 D1.3 v33.02,28.19 | R39.1 v32.77,24.89
  Bottom 0.203: v33.02,28.19 33.02,25.15 v32.77,24.89
N$39
  Top 0.203: X1.1 22.78,30.81 25.4,28.19 27.43,28.19 | 27.43,28.19 28.45,28.19 28.7,28.45 28.7,28.95 R32.1 | 27.43,28.19 C22.1
N$40  (via drill 0.23)
  Top 0.203: IC2.23 35.88,23.94 34.8,22.86 34.8,14.22 38.61,10.41 v55.88,10.41 | R18.1 v55.88,6.1 55.56,6.41 D3.4
  Bottom 0.203: v55.88,10.41 v55.88,6.1
N$41  (via drill 0.23)
  Top 0.203: v49.78,28.45 50.29,27.94 IC2.63 | X1.3 25.48,27.26 25.91,27.69 27.43,27.69 | 27.43,27.69 28.7,27.69 29.21,28.19 v30.23,28.19 | 27.43,27.69 C23.1
  Bottom 0.203: v49.78,28.45 49.53,28.7 35.81,28.7 35.31,29.21 31.24,29.21 v30.23,28.19
N$42  (via drill 0.23)
  Top 0.203: IC2.22 35.26,24.34 34.04,23.11 34.04,13.72 37.85,9.91 v58.42,9.91 | R19.1 v58.42,6.1 56.9,7.62 D3.5
  Bottom 0.203: v58.42,9.91 v58.42,6.1
N$44  (via drill 0.23)
  Top 0.203: IC2.21 34.65,24.74 33.27,23.37 33.27,13.21 37.08,9.4 v60.96,9.4 61.72,9.4 62.87,8.26 D6.1 | v60.96,6.1 R20.1
  Bottom 0.203: v60.96,9.4 v60.96,6.1
N$46
  Top 0.203: IC2.20 34.03,25.14 32.51,23.62 32.51,12.7 36.32,8.89 61.47,8.89 62.48,7.87 | 62.48,7.87 62.48,6.6 R21.1 | D6.2 62.74,7.62 62.48,7.87
N$52  (via drill 0.23)
  Top 0.203: IC2.32 43.32,16.37 46.23,13.46 69.6,13.46 73.66,9.4 v73.66,8.13 R24.1 | D4.1 75.82,8.26 v75.69,8.13
  Bottom 0.203: v73.66,8.13 v75.69,8.13
N$54
  Top 0.203: IC2.33 43.72,16.73 46.48,13.97 71.63,13.97 74.93,10.67 74.93,7.62 | 74.93,7.62 74.93,6.85 R25.1 | 74.93,7.62 D4.2
N$56
  Top 0.203: IC2.34 44.12,17.09 46.74,14.48 75.44,14.48 79.76,10.16 79.76,6.6 79.5,6.35 | 79.5,6.35 R26.1 | D4.4 78.87,6.99 79.5,6.35
N$64
  Top 0.203: IC2.43 47.72,19.53 47.24,19.05 47.24,17.53 48.26,16.51 77.47,16.51 84.84,9.14 89.66,9.14 90.17,8.64 90.17,6.99 | 90.17,6.99 D5.4 | R30.1 90.17,6.9 90.17,6.99
N$66  (via drill 0.23)
  Top 0.203: IC2.44 48.12,19.16 47.75,18.8 47.75,17.78 48.01,17.53 48.12,17.41 48.51,17.02 77.98,17.02 85.34,9.65 90.42,9.65 91.44,8.64 v91.44,8.38 R31.1 | D5.5 89.15,7.62 89.41,7.87 v89.41,8.38
  Bottom 0.203: v91.44,8.38 v89.41,8.38
OC1/RD0
  Top 0.203: IC2.72 53.64,31.54 54.36,32.26 54.36,33.02 54.61,33.27 54.61,49.53 J14.7
OC2/RD1
  Top 0.203: IC2.76 50.52,43.46 49.53,44.45 49.53,49.53 J14.11
OC3/RD2
  Top 0.203: IC2.77 50.12,42.84 46.99,45.97 46.99,49.53 J14.13
OC4/RD3
  Top 0.203: IC2.78 49.72,42.23 43.94,48.01 43.94,51.05 42.67,52.32 39.62,52.32 39.12,51.82 J3.3
OC5/PMWR/RD4
  Top 0.203: IC2.81 48.52,39.87 48.51,39.88 48.51,40.39 41.91,46.99 41.15,46.99 40.39,47.75 40.39,49.02 39.88,49.53 37.85,49.53 J3.5
P32_MCLR  (via drill 0.23 pad 0.41)
  Top 0.203: R38.2 C12.2 19.56,39.62 20.32,38.86 JP5.1 | J11.1 5.33,29.21 6.46,28.08 D8.3 | J10.1 33.02,11.18 31.75,12.45 31.75,23.11 30.74,24.12 R39.2 29.22,23.37 20.83,23.37 v20.32,23.88 JP5.2 | R8.2 v11.43,48.77 R4.1
  Bottom 0.203: JP5.2 JP5.1 | v11.43,48.77 8.64,48.77 3.05,43.18 3.05,29.77 J11.1 8.94,23.88 v20.32,23.88
P32_PGC  (via drill 0.23 pad 0.41)
  Top 0.203: IC2.26 39.27,21.24 v37.34,19.3 37.34,15.49 40.39,12.45 63.5,12.45 67.06,8.89 67.06,6.65 66.78,6.37 | 66.78,6.37 R22.1 | D6.4 66.17,6.99 66.78,6.37 | R41.1 v8.13,19.05
  Bottom 0.203: v37.34,19.3 8.38,19.3 v8.13,19.05
P32_PGD  (via drill 0.23, 0.23 pad 0.41)
  Top 0.203: IC2.27 41.32,20.24 41.15,20.07 39.12,20.07 38.35,19.3 v38.35,18.54 38.35,15.75 41.15,12.95 64.26,12.95 68.07,9.14 v68.07,7.62 68.07,6.09 R23.1 | v66.55,7.62 D6.5 | v8.13,21.59 R40.1
  Bottom 0.203: v68.07,7.62 v66.55,7.62 | v8.13,21.59 6.86,20.32 6.86,19.05 7.62,18.29 8.38,18.29 8.64,18.54 v38.35,18.54
PMA2/EREFCLK/SS2A/RG9  (via drill 0.23)
  Top 0.203: J8.1 95.25,8.89 93.22,8.89 83.57,18.54 78.23,18.54 v72.9,23.88 | IC2.14 40.53,27.54 v42.16,25.91
  Bottom 0.203: v72.9,23.88 65.79,23.88 64.26,25.4 J13.5 63.25,25.65 62.99,25.91 v42.16,25.91
PMA3/ECRSDV/SDO2A/RG8  (via drill 0.23)
  Top 0.203: J8.11 95.25,21.59 81.79,21.59 v79.25,24.13 79.25,27.43 JP4.1 | IC2.12 41,28.34 v41.66,27.69
  Bottom 0.203: v41.66,27.69 52.83,27.69 53.85,26.67 67.56,26.67 68.83,25.4 JP3.3 74.93,24.13 v79.25,24.13
PMA4/SDI2A/RG7  (via drill 0.23)
  Top 0.203: IC2.11 40.68,28.74 42.42,30.48 v42.42,30.99 | v77.47,39.88 73.66,36.07 JP3.1 74.93,29.21 74.93,27.18 76.2,25.91 JP4.3
  Bottom 0.203: JP3.1 67.82,30.48 66.55,31.75 56.9,31.75 56.13,30.99 v42.42,30.99 | J9.9 95.25,41.91 93.22,41.91 91.19,39.88 v77.47,39.88
PMA5/SCK2A/RG6  (via drill 0.23)
  Top 0.203: IC2.10 40.32,29.14 v41.4,30.23 | J8.2 84.84,19.3 78.74,19.3 v74.17,23.88 | v67.06,26.16 66.55,26.67 64.77,26.67 J13.3
  Bottom 0.203: v74.17,23.88 73.66,23.88 73.15,24.38 68.83,24.38 v67.06,26.16 | J13.3 56.9,27.94 54.61,30.23 v41.4,30.23
PMCS2  (via drill 0.23)
  Top 0.203: IC2.70 54.11,30.74 54.86,31.5 v54.86,32.51
  Bottom 0.203: J8.16 93.22,27.94 88.14,33.02 56.13,33.02 55.63,32.51 v54.86,32.51
PMD0  (via drill 0.23)
  Top 0.203: IC2.93 43.72,32.73 v43.94,32.51
  Bottom 0.203: J9.1 95.25,29.21 93.22,29.21 88.65,33.78 55.88,33.78 55.37,33.27 49.28,33.27 48.51,32.51 v43.94,32.51
PMD1  (via drill 0.23)
  Top 0.203: IC2.94 43.32,33.39 v43.18,33.27
  Bottom 0.203: J9.2 93.22,30.48 89.15,34.54 55.37,34.54 54.86,34.04 49.28,34.04 48.51,33.27 v43.18,33.27
PMD2  (via drill 0.23)
  Top 0.203: IC2.98 41.72,33.08 v41.66,33.02
  Bottom 0.203: J9.3 95.25,31.75 93.22,31.75 89.66,35.31 54.86,35.31 54.36,34.8 49.28,34.8 48.51,34.04 42.67,34.04 v41.66,33.02
PMD3  (via drill 0.23)
  Top 0.203: IC2.99 41.32,33.7 v41.15,33.53
  Bottom 0.203: J9.4 93.22,33.02 90.17,36.07 54.61,36.07 54.1,35.56 49.28,35.56 48.51,34.8 42.42,34.8 v41.15,33.53
PMD4  (via drill 0.23)
  Top 0.203: IC2.100 40.23,34.64 v40.13,34.54
  Bottom 0.203: J9.5 95.25,34.29 93.22,34.29 90.68,36.83 54.1,36.83 53.59,36.32 49.28,36.32 48.51,35.56 41.15,35.56 v40.13,34.54
PMD5  (via drill 0.23)
  Top 0.203: IC2.3 40.2,31.94 v40.39,32
  Bottom 0.203: J9.6 93.22,35.56 91.19,37.59 53.85,37.59 53.34,37.08 49.28,37.08 48.51,36.32 40.64,36.32 39.12,34.8 39.12,33.78 40.39,32.51 v40.39,32
PMD6  (via drill 0.23)
  Top 0.203: IC2.4 36.02,31.54 34.29,33.27 v34.29,35.31
  Bottom 0.203: J9.7 95.25,36.83 93.22,36.83 91.69,38.35 76.45,38.35 75.69,39.12 54.61,39.12 53.85,39.88 38.86,39.88 v34.29,35.31
PMD7  (via drill 0.23)
  Top 0.203: IC2.5 35.66,31.14 33.78,33.02 v33.78,35.81
  Bottom 0.203: J9.8 92.96,39.12 76.71,39.12 75.95,39.88 55.37,39.88 54.61,40.64 38.61,40.64 v33.78,35.81
PMRD/RD5  (via drill 0.23)
  Top 0.203: IC2.82 48.12,33.67 v49.78,32
  Bottom 0.203: J8.15 95.25,26.67 93.22,26.67 87.63,32.26 56.39,32.26 56.13,32 v49.78,32
RA0  (via drill 0.23)
  Top 0.203: IC2.17 33.86,26.34 32.51,27.69 32.51,30.99 30.99,32.51 v30.99,37.34
  Bottom 0.203: J14.2 62.23,49.53 60.2,49.53 59.69,49.02 59.69,47.5 55.88,43.69 37.34,43.69 v30.99,37.34
RA1  (via drill 0.23)
  Top 0.203: IC2.38 45.72,28.45 46.99,29.72 v46.99,31.75 | v50.04,32.77 51.05,33.78 51.05,43.94 50.29,44.7 v50.29,45.21 | J14.4 59.69,49.53 v56.64,49.53
  Bottom 0.203: v46.99,31.75 48.51,31.75 49.53,32.77 v50.04,32.77 | v56.64,49.53 50.04,49.53 49.53,49.02 49.53,45.97 v50.29,45.21
RA4
  Top 0.203: IC2.60 56.46,26.74 57.66,27.94 57.66,28.96 58.42,29.72 J14.6
RA5
  Top 0.203: IC2.61 56.1,27.14 56.9,27.94 56.9,29.21 57.66,29.97 57.66,44.96 55.88,46.74 J14.8
RA6
  Top 0.203: IC2.91 44.52,36 43.94,36.58 43.94,38.86 36.58,46.23 J3.6
RA7
  Top 0.203: IC2.92 44.12,35.64 43.43,36.32 43.43,37.85 39.12,42.16 38.1,42.16 34.04,46.23 J3.8
RC13
  Top 0.203: J14.12 50.8,47.24 51.52,46.69 R5.2
RD7  (via drill 0.23)
  Top 0.203: IC2.84 47.32,35.89 47.75,36.32 47.75,40.13 v42.67,45.21
  Bottom 0.203: v42.67,45.21 J14.16
RD9  (via drill 0.23)
  Top 0.203: IC2.69 54.72,30.34 55.37,30.99 v55.37,46.48
  Bottom 0.203: J14.10 53.59,48.26 v55.37,46.48
RD13  (via drill 0.23)
  Top 0.203: IC2.80 48.92,41 v44.96,44.96
  Bottom 0.203: v44.96,44.96 J14.14
RG0
  Top 0.203: IC2.90 44.92,36.36 44.45,36.83 44.45,40.64 39.12,45.97 J3.4
RG1  (via drill 0.23)
  Top 0.203: IC2.89 45.32,36.47 44.96,36.83 44.96,41.66 v40.13,46.48
  Bottom 0.203: v40.13,46.48 J3.2
RG12
  Top 0.203: IC2.96 42.52,36.73 38.86,40.39 34.8,40.39 28.96,46.23 J3.12
RG13
  Top 0.203: IC2.97 42.12,36.37 39.12,39.37 33.78,39.37 26.42,46.74 J3.14
RG14
  Top 0.203: IC2.95 42.92,37.34 38.86,41.4 36.32,41.4 31.5,46.23 J3.10
RG15  (via drill 0.23)
  Top 0.203: IC2.1 39.02,38.45 v38.86,38.61 | v74.42,38.35 76.71,40.64 J9.10
  Bottom 0.203: v38.86,38.61 39.37,39.12 53.59,39.12 54.36,38.35 v74.42,38.35
SCL1  (via drill 0.23)
  Top 0.203: IC2.66 55.81,29.14 56.9,30.23 v56.9,42.42
  Bottom 0.203: J4.1 84.33,48.77 68.07,48.77 65.28,45.97 60.45,45.97 v56.9,42.42
SCL2/RA2  (via drill 0.23)
  Top 0.203: v50.29,26.67 51.02,25.94 IC2.58
  Bottom 0.203: J3.9 30.23,49.53 30.23,46.99 28.7,45.47 28.7,38.61 29.46,37.85 29.46,27.18 32.26,24.38 38.35,24.38 41.15,27.18 49.78,27.18 v50.29,26.67
SDA1  (via drill 0.23)
  Top 0.203: IC2.67 55.19,29.54 56.13,30.48 v56.13,42.93
  Bottom 0.203: J4.2 82.55,49.53 67.82,49.53 65.02,46.74 59.94,46.74 v56.13,42.93
SDA2/RA3  (via drill 0.23)
  Top 0.203: v84.07,28.7 R35.1 | v49.28,26.67 49.78,27.18 50.55,27.18 51.38,26.34 IC2.59 56.82,26.34 58.42,27.94 v58.42,28.7 | v67.06,29.72 66.55,29.21 65.28,29.21 v64.77,28.7
  Bottom 0.203: J3.11 27.69,49.53 27.69,38.61 28.7,37.59 28.7,25.91 30.99,23.62 38.35,23.62 41.4,26.67 v49.28,26.67 | v84.07,28.7 78.74,28.7 78.23,29.21 68.58,29.21 68.07,29.72 v67.06,29.72 | v64.77,28.7 64.26,29.21 58.93,29.21 v58.42,28.7
T1CK/RC14
  Top 0.203: J14.9 52.07,49.53 52.07,47.24 52.54,46.78 R6.2
T5CK/RC4  (via drill 0.23)
  Top 0.203: IC2.9 34.98,29.54 32,32.51 32,37.59 v29.46,40.13
  Bottom 0.203: v29.46,40.13 32.77,43.43 32.77,49.53 J3.7
U1ARX  (via drill 0.23)
  Top 0.203: J14.1 64.77,49.53 64.77,47.5 62.23,44.96 62.23,26.92 58.85,23.54 IC2.52 50.88,23.54 v49.53,24.89 | v18.54,38.35 R1.2 | v40.39,24.89 40.39,23.11 39.88,22.61 37.59,22.61 37.08,22.1 v37.08,20.07
  Bottom 0.203: v18.54,38.35 18.54,26.92 25.4,20.07 v37.08,20.07 | v40.39,24.89 v49.53,24.89
U1ATX  (via drill 0.23)
  Top 0.203: J14.3 62.23,49.53 62.23,47.5 61.47,46.74 61.47,27.18 58.23,23.94 IC2.53 51.5,23.94 v50.55,24.89 | v20.57,39.88 17.02,43.43 R2.2 | v37.85,20.83 39.12,22.1 40.13,22.1 41.15,23.11 v41.15,25.4
  Bottom 0.203: v20.57,39.88 21.59,38.86 21.59,24.89 25.65,20.83 v37.85,20.83 | v41.15,25.4 50.04,25.4 v50.55,24.89
U1BRX
  Top 0.203: IC2.47 49.32,19.51 51.31,17.53 66.29,17.53 67.31,18.54 72.14,23.37 72.14,37.59 81.28,46.74 J4.3
U1BTX
  Top 0.203: IC2.48 49.72,19.88 51.56,18.03 65.53,18.03 66.55,19.05 66.8,19.3 71.37,23.88 71.37,39.37 78.74,46.74 J4.4
U3ARX
  Top 0.203: IC2.49 50.12,20.24 51.82,18.54 65.02,18.54 70.61,24.13 70.61,41.15 76.2,46.74 J4.5
U3ATX
  Top 0.203: IC2.50 50.52,20.6 52.07,19.05 64.52,19.05 69.85,24.38 69.85,42.93 73.66,46.74 J4.6
U3BRX/AC1RX/RF12  (via drill 0.23)
  Top 0.203: J4.7 71.12,46.74 68.33,43.94 68.33,24.89 67.06,23.62 v61.47,23.62 | IC2.40 46.52,23.15 v46.99,23.62
  Bottom 0.203: v46.99,23.62 v61.47,23.62
U3BTX/AC1TX/RF13  (via drill 0.23)
  Top 0.203: J4.8 68.58,46.48 67.56,45.47 67.56,25.15 66.55,24.13 v64.52,24.13 | IC2.39 46.12,23.77 v46.48,24.13
  Bottom 0.203: v46.48,24.13 v64.52,24.13
USB5V0  (via drill 0.33, 0.33 pad 0.41)
  Top 0.406: R7.2 v9.91,34.54
  Bottom 0.406: v9.91,34.54 8.89,34.54
  other vias: 7.62,40.39 8.38,40.39 6.86,40.39 13.46,29.21 12.45,28.45 12.45,27.69
  pour Top (isolate 0.254, no thermals): 8.89,39.37 6.35,39.37 6.35,40.89 8.89,40.89
  pour Bottom: 5.59,41.15 9.4,41.15 9.4,39.37 8.38,39.37 8.38,37.34 9.4,37.34 9.4,35.31 11.18,35.31 11.18,30.73 14.48,30.73 14.48,27.18 7.11,27.18 5.59,28.7
  pour Top: 14.22,29.72 11.94,29.72 11.94,27.18 14.22,27.18
USBD+  (via drill 0.23)
  Top 0.203: IC2.57 53.48,25.54 53.85,25.91 57.15,25.91 59.18,27.94 v59.18,43.69 | J9.11 95.76,43.18 94.49,44.45 v86.61,44.45
  Bottom 0.203: v59.18,43.69 59.94,44.45 v86.61,44.45
USBD-  (via drill 0.23)
  Top 0.203: IC2.56 53.59,25.14 53.85,25.4 57.4,25.4 59.69,27.69 v59.69,43.18 | v86.11,43.94 93.47,43.94 93.73,43.69
  Top 0.254: J9.12 93.98,43.43 93.73,43.69
  Bottom 0.203: v59.69,43.18 59.69,43.43 60.2,43.94 v86.11,43.94
USBID  (via drill 0.23)
  Top 0.203: IC2.51 53.31,23.14 54.1,22.35 66.8,22.35 69.09,24.64 v69.09,42.93 | v78.74,42.93 v89.41,42.93
  Bottom 0.203: J9.13 95.25,46.99 93.47,46.99 v89.41,42.93 | v69.09,42.93 v78.74,42.93
VBUS  (via drill 0.23)
  Top 0.203: IC2.54 57.61,24.34 60.71,27.43 v60.71,42.16 | v77.98,42.16 v90.42,42.16
  Bottom 0.203: v90.42,42.16 J9.14 | v60.71,42.16 v77.98,42.16
VCC3V3  (via drill 0.23, 0.33, 0.33 pad 0.41)
  Top 0.203: IC2.86 46.52,36.03 46.23,36.32 | R10.2 v21.08,49.78 | R11.2 v21.08,46.74 | D1.2 34.66,27.54 v34.8,27.69 | D5.3 87.25,6.99 87.63,7.37 v87.63,8.38 87.76,8.26 D5.6 | D4.3 77.09,6.99 77.47,7.37 v77.47,8.38 77.6,8.26 D4.6 | D7.3 53.47,41.78 53.09,42.16 v52.07,42.16 52.2,42.29 D7.6 | D6.3 64.39,6.99 64.77,7.37 v64.77,8.38 64.9,8.26 D6.6 | D3.6 54.99,8.26 54.61,7.87 v54.61,6.86 54.48,6.99 D3.3 | LD4.A 86.7,28.79 v86.61,28.7 | IC1.1 15.21,41.37 v15.49,41.66 C18.1 | v11.43,45.47 R4.2 | R12.2 v6.6,1.27
  Top 0.254: IC2.2 38.02,32.34 C2.1 37.41,33.1 C2.1 | IC2.16 37.4,26.74 C3.1 | IC2.37 45.32,19.67 v45.21,19.56 | IC2.46 48.92,19.71 v48.77,19.56 | IC2.62 53.74,27.54 v53.85,27.69 | IC2.55 54,24.74 v54.1,24.89
  Top 0.305: C2.1 v37.33,33.52 v37.34,33.53 | C3.1 37.33,27.19 v37.34,27.43
  Top 0.406: C4.1 v45.21,19.56 | C5.1 v48.77,19.56 | v53.85,27.69 C6.1 | v54.1,24.89 C11.1 | C7.1 v45.72,36.83 46.23,36.32
  Top 0.61: IC5.4 14.04,20.64 v13.97,20.57 | R3.1 v40.13,16.26
  other vias: 11.68,16.51 12.7,16.51 11.68,15.49 12.7,15.49
  pour Route15 (rank 2): 0,53.34 0.51,11.94 13.21,11.94 13.21,5.08 13.21,4.83 10.16,1.78 0,1.78 0,0 101.6,0 101.6,53.34
  pour Top: 13.97,17.27 9.4,17.27 9.4,12.7 13.97,12.7
VCC5V0  (via drill 0.33, 0.33 pad 0.53)
  Top 0.203: IC3.3 IC3.2
  Top 0.305: IC1.19 12.71,34.53 13.21,34.04 13.21,33.54 C25.1
  Top 0.813: 13.21,33.54 C25.1 C24.1 13.22,30.48 15.49,30.48 15.49,27.69
  Top 1.27: JP1.1 19.81,7.87 22.35,7.87 IC4.2 22.35,16.51
  other vias: 20.32,14.73 21.59,14.73 22.86,14.73 24.13,14.73 35.56,7.62 36.58,7.62 37.59,7.62 38.61,7.62
  pour Top (rank 2): 16.51,21.59 13.46,21.59 13.46,28.45 19.3,28.45 19.3,22.86 25.91,22.86 25.91,13.46 16.51,13.46
  pour Bottom: 18.8,17.02 39.12,17.02 39.12,6.86 18.8,6.86
  pour Route15 (no thermals): 36.83,0 36.83,6.6 34.8,6.6 34.8,8.64 39.37,8.64 39.37,2.54 91.95,2.54 91.95,6.35 97.79,6.35 97.79,49.53 92.2,49.53 92.2,53.34 101.6,53.34 101.6,0
VCMP
  Top 0.61: R13.1 10.66,20.64 | R14.2 10.66,20.83 10.66,20.64 | 10.66,20.64 IC5.3
VIN
  Top 0.406: J2.1 10.52,9.97
  Top 0.61: 10.52,9.97 10.52,11.94 7.87,11.94 7.87,18.03 9.65,18.03 R13.2
  Bottom 1.27: 22.35,5.59 JP1.2 | 22.35,5.59 10.92,5.59 10.52,5.99 J2.1 | J10.6 45.72,5.59 22.35,5.59
  pour Bottom (no thermals): 9.91,9.65 10.41,10.16 10.92,10.16 11.43,9.65 11.43,5.59 10.92,5.08 10.41,5.08 9.91,5.59
  pour Route15 (no thermals): 9.91,9.65 10.41,10.16 10.92,10.16 11.43,9.65 11.43,5.59 10.92,5.08 10.41,5.08 9.91,5.59
  pour Top (no thermals): 9.91,9.65 10.41,10.16 10.92,10.16 11.43,9.65 11.43,5.59 10.92,5.08 10.41,5.08 9.91,5.59
  pour Route2 (no thermals): 9.91,5.59 9.91,9.65 10.41,10.16 10.92,10.16 11.43,9.65 11.43,5.59 10.92,5.08 10.41,5.08
VREF+/PMA6/RA10
  Top 0.203: R15.2 22.86,46.74 22.61,46.99 22.61,46.98 22.61,50.29 23.11,50.8 J3.15
  Bottom 0.203: J8.10 91.19,23.11 46.74,23.11 45.47,24.38 39.88,24.38 38.61,23.11 30.23,23.11 27.94,25.4 27.94,37.34 26.92,38.35 26.92,45.72 25.15,47.5 25.15,49.53 J3.15
VREF-/PMA7/RA9
  Top 0.203: J3.16 24.38,47.75 R33.2
(copper drawn outside any net)
  shapes: Bottom area x1

## Text on the board
tPlace: 5V0 | 22 | 23 | 14 | 15 | 16 | 17 | 18 | 19 | 20 | 21 | RESET | 1 | 0 | GND | 13 | 12 | 11 | 10 | 9 | 8 | 7 | 6 | 5 | 4 | 3 | 2 | 24 | 25 | AREF | TX0 | RX0 | TX3 | RX3 | TX2 | RX2 | TX1 | RX1 | SDA | SCL | 26 | 27 | 1 | 85 | 84 | 83 | 82 | 81 | 80 | 79 | 78 | 77 | 76 | 75 | 74 | 73 | 72 | 71 | 70 | COMMUNICATION | PWM/DIGITAL | 28 | 29 | 30 | 31 | DIGITAL | 32 | 33 | 34 | 35 | 1 | 36 | 37 | 1 | MASTER | SPI | SPI | 38 | 39 | SLAVE | SELECT | 40 | 41 | 42 | 43 | 44 | 45 | 46 | 47 | 48 | 49 | ICSP | ANALOG IN | 50 | 51 | - | 52 | 53 | A0 | A1 | A2 | A3 | A4 | A5 | A6 | A7 | A8 | A9 | A10 | A11 | A12 | A13 | A14 | A15 | POWER | POWER | SELECT | + | BYP | REG | GND | RST | 3V3 | 5V0 | GND | GND | VIN | 15V MAX!
bPlace: REV C | PB200-202
Measures: 2.1" | 2.0" | Slot Drills | 0.026 x 0.125" | 0.1" | 0.6" | 3.8" | 4.0"